# EAGLE design controller_up (EAGLE 5.00)
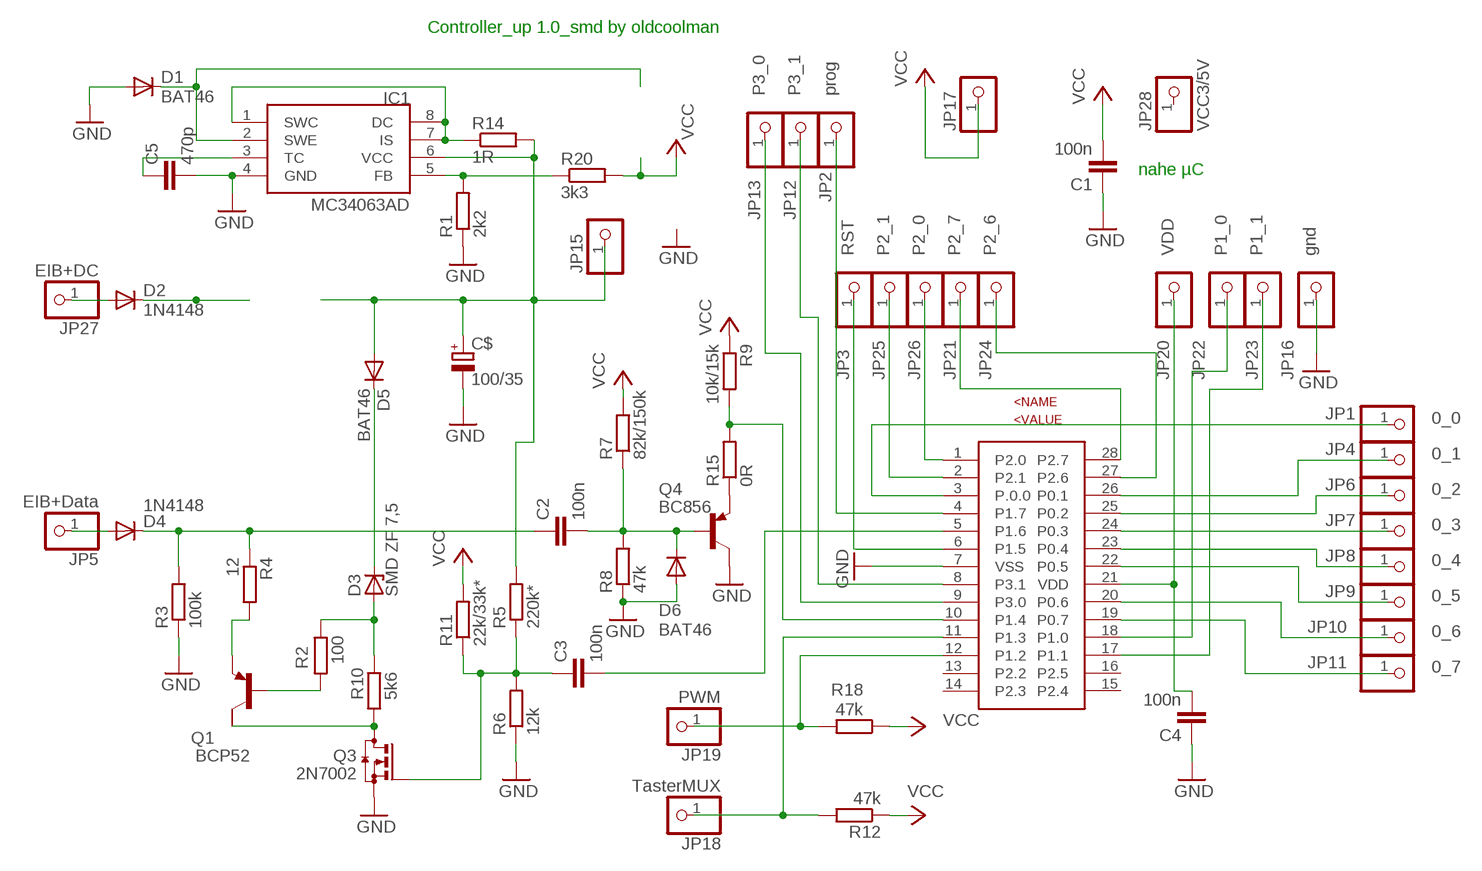
[diagram p0: schematic, sheet 1]

## Parts
C1  100n  C-EUC1206  [C1206]
C2  100n  C-EUC1206  [C1206]
C3  100n  C-EUC1206  [C1206]
C4  100n  C-EUC1206  [C1206]
C5  470p  C-EUC1206  [C1206]
C$  100/35  C_EU_HE3,3X13LIEGEND  [E3,3-7,5X13]
D1  BAT46  DIODE-MINIMELF  [MINIMELF]
D2  1N4148  DIODE-MINIMELF  [MINIMELF]
D3  SMD ZF 7,5  ZPD  [MINIMELF]
D4  1N4148  DIODE-MINIMELF  [MINIMELF]
D5  BAT46  DIODE-MINIMELF  [MINIMELF]
D6  BAT46  DIODE-MINIMELF  [MINIMELF]
IC1  MC34063AD  [SOIC8]
JP1  0_0  PINHD-1X1  [1X01]
JP2  prog  PINHD-1X1  [1X01]
JP3  RST  PINHD-1X1  [1X01]
JP4  0_1  PINHD-1X1  [1X01]
JP5  EIB+Data  PINHD-1X1  [1X01]
JP6  0_2  PINHD-1X1  [1X01]
JP7  0_3  PINHD-1X1  [1X01]
JP8  0_4  PINHD-1X1  [1X01]
JP9  0_5  PINHD-1X1  [1X01]
JP10  0_6  PINHD-1X1  [1X01]
JP11  0_7  PINHD-1X1  [1X01]
JP12  P3_1  PINHD-1X1  [1X01]
JP13  P3_0  PINHD-1X1  [1X01]
JP15  PINHD-1X1  [1X01]
JP16  gnd  PINHD-1X1  [1X01]
JP17  PINHD-1X1  [1X01]
JP18  TasterMUX  PINHD-1X1  [1X01]
JP19  PWM  PINHD-1X1  [1X01]
JP20  VDD  PINHD-1X1  [1X01]
JP21  P2_7  PINHD-1X1  [1X01]
JP22  P1_0  PINHD-1X1  [1X01]
JP23  P1_1  PINHD-1X1  [1X01]
JP24  P2_6  PINHD-1X1  [1X01]
JP25  P2_1  PINHD-1X1  [1X01]
JP26  P2_0  PINHD-1X1  [1X01]
JP27  EIB+DC  PINHD-1X1  [1X01]
JP28  VCC3/5V  PINHD-1X1  [1X01]
Q1  BCP52  FZT753SMD  [SOT223]
Q3  2N7002  BSS123  [SOT23]
Q4  BC856  BC856ALT1SMD  [SOT23-BEC]
R1  2k2  R-EU_R1206  [R1206]
R2  100  R-EU_M1206  [M1206]
R3  100k  R-EU_M1206  [M1206]
R4  12  R-EU_R1206  [R1206]
R5  220k*  R-EU_R1206  [R1206]
R6  12k  R-EU_M1206  [M1206]
R7  82k/150k  R-EU_R1206  [R1206]
R8  47k  R-EU_M1206  [M1206]
R9  10k/15k  R-EU_R1206  [R1206]
R10  5k6  R-EU_M1206  [M1206]
R11  22k/33k*  R-EU_R1206  [R1206]
R12  47k  R-EU_M1206  [M1206]
R14  1R  R-EU_M1206  [M1206]
R15  0R  R-EU_M1206  [M1206]
R18  47k  R-EU_M1206  [M1206]
R20  3k3  R-EU_M1206  [M1206]
U$1  LPC936TSSOP28  [TSSOP28]

## Nets
GND: C1.1 C4.1 C5.2 C$.- D1.A D6.A IC1.4(GND) JP16.1 Q3.2(S) Q4.C R1.1 R3.1 R6.1 R8.1 U$1.7(VSS)
N$1: R9.2 R15.2 U$1.10(P1.4)
N$2: C2.2 D6.C Q4.B R7.1 R8.2
N$3: IC1.5(FB) R1.2 R20.1
N$4: IC1.1(SWC) IC1.7(IS) IC1.8(DC) R14.1
N$5: C3.2 U$1.5(P1.6)
N$6: Q1.2(C) Q3.3(D) R10.1
N$7: C$.+ D5.A IC1.6(VCC) JP15.1 R5.2 R14.2
N$8: D2.C
N$9: C2.1 D4.C R3.2 R4.1
N$10: D1.C IC1.2(SWE)
N$11: D3.A R2.1 R10.2
N$12: Q1.3(E) R4.2
N$13: C5.1 IC1.3(TC)
N$14: Q1.1(B) R2.2
N$15: JP2.1 U$1.4(P1.7)
N$16: JP21.1 U$1.28(P2.7)
N$17: JP4.1 U$1.26(P0.1)
N$18: JP1.1 U$1.3(P.0.0)
N$19: JP6.1 U$1.25(P0.2)
N$20: JP7.1 U$1.24(P0.3)
N$21: JP8.1 U$1.23(P0.4)
N$22: JP9.1 U$1.22(P0.5)
N$23: JP10.1 U$1.20(P0.6)
N$24: JP11.1 U$1.19(P0.7)
N$25: JP12.1 U$1.8(P3.1)
N$26: JP13.1 U$1.9(P3.0)
N$28: D2.A JP27.1
N$29: JP22.1 U$1.18(P1.0)
N$30: JP23.1 U$1.17(P1.1)
N$31: JP3.1 U$1.6(P1.5)
N$32: C4.2 JP20.1 U$1.21(VDD)
N$33: JP19.1 R18.2 U$1.12(P1.2)
N$34: C3.1 Q3.1(G) R5.1 R6.2 R11.1
N$35: Q4.E R15.1
N$36: JP24.1 U$1.27(P2.6)
N$37: JP26.1 U$1.1(P2.0)
N$38: JP25.1 U$1.2(P2.1)
N$40: D3.C D5.C
N$42: JP18.1 R12.2 U$1.11(P1.3)
N$44: D4.A JP5.1
VCC: C1.2 JP17.1 R7.2 R9.1 R11.2 R12.1 R18.1 R20.2
Unconnected: JP28.1 Q1.4(C/) U$1.13(P2.2) U$1.14(P2.3) U$1.15(P2.4) U$1.16(P2.5)

## Notes on the sheet
- Controller_up 1.0_smd by oldcoolman
- nahe µC

## Library data of the parts
C1-C5 = rcl:C-EU: CAPACITOR, European symbol
C$ = rcl:C_EU_H
D1 D2 D4-D6 = diode:DIODE-: DIODE
D3 = diode:ZPD: Z DIODE 500 mW
IC1 = mc34063:MC34063
JP1-JP13 JP15-JP28 = pinhead:PINHD-1X1: PIN HEADER
Q1 = transistor-pnp:FZT753SMD: PNP Transistor
Q3 = transistor-small-signal:BSS123: N-CHANNEL MOS FET
Q4 = transistor-pnp:BC856*: PNP Transistror
R1-R12 R14 R15 R18 R20 = rcl:R-EU_: RESISTOR, European symbol
U$1 = freebuslpc:LPC936: C51 Based Microcontroller LPC936 ADC and 16kbyte Flash

## Board
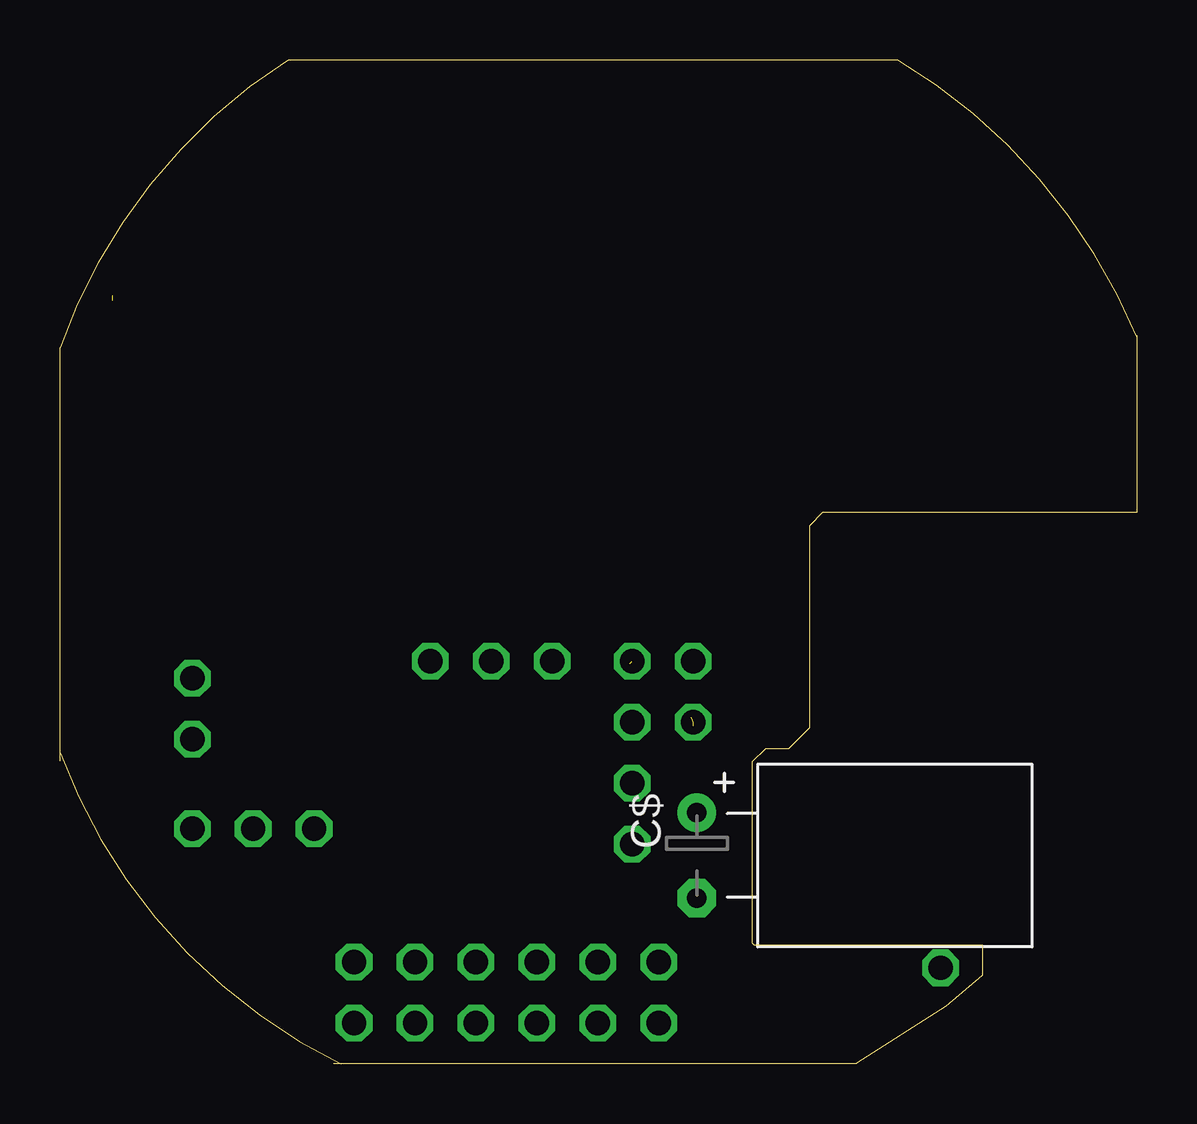
[diagram p1: board, top side]
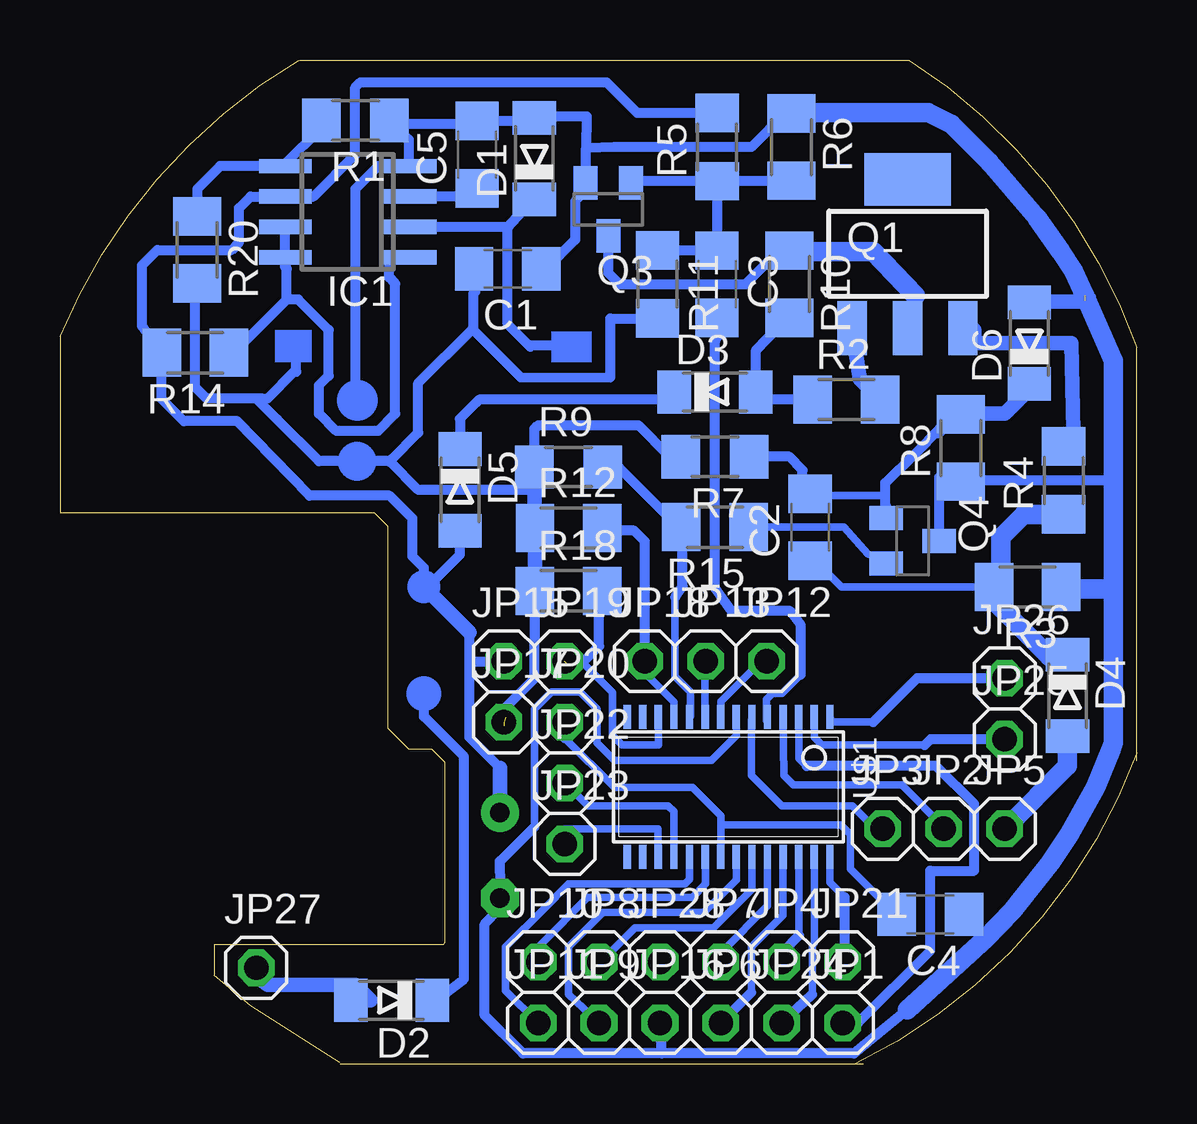
[diagram p2: board, bottom side, seen from below]

Size 44.89 x 41.84 mm. Coordinates in mm from the lower left corner, seen from the top.
Outline: 34.91,41.84 9.5,41.84 arc38 0,29.85
Outline: 0.01,12.63 0,29.85
Outline: 33.21,0 11.41,0
Outline: 44.89,30.31 arc36 34.92,41.84
Outline: 0.01,12.96 arc44 11.72,0
Outline: 44.88,30.35 44.88,22.97 31.79,22.97 31.23,22.42 31.23,14 30.36,13.13 29.4,13.13 28.85,12.57 28.85,5.03 28.93,4.95 38.45,4.95 38.45,3.68 36.95,2.41 33.21,0.03
Copper layers (1*16): Top 0.035mm / dielectric 1.5mm / Bottom 0.035mm
Design rules "default": minimum track width 10mil, minimum drill 24mil, track to track 8mil, track to pad 8mil, pad to pad 8mil, via to via 8mil, smd to smd 8mil, copper to edge 40mil, drill to drill 8mil, minimum pad ring 10mil, minimum via ring 8mil, stop-mask expansion 4mil, vias tented up to drill 0mil, thermal gap 10mil

### Footprints (pad centres in the part's own frame; a part is rotated, then mirrored left to right if it is on the bottom)
C1206 = smd 1.6 x 1.8: 1 -1.4,0; 2 1.4,0
E3,3-7,5X13 = drill 0.813 pad 1.6 round: + -1.778,0 | drill 0.813 pad 1.6 octagon: - 1.778,0
MINIMELF = smd 1.4 x 1.8: A 1.7,0; C -1.7,0
SOIC8 = smd 0.6 x 2.2: 1 -1.905,-2.6; 2 -0.635,-2.6; 3 0.635,-2.6; 4 1.905,-2.6; 5 1.905,2.6; 6 0.635,2.6; 7 -0.635,2.6; 8 -1.905,2.6
1X01 = drill 1.016 octagon: 1 0,0
SOT223 = smd 1.219 x 2.235: 1 -2.311,-3.099; 2 0,-3.099; 3 2.311,-3.099 | smd 3.6 x 2.2: 4 0,3.099
SOT23 = smd 1 x 1.4: 1 -0.95,-1.1; 2 0.95,-1.1; 3 0,1.1
SOT23-BEC = smd 1 x 1.4: B -0.95,-1.1; C 0,1.1; E 0.95,-1.1
R1206 = smd 1.6 x 1.803: 1 -1.422,0; 2 1.422,0
M1206 = smd 1.6 x 2: 1 -1.4,0; 2 1.4,0
TSSOP28 = smd 0.305 x 0.991: 1 -4.225,-2.918; 2 -3.575,-2.918; 3 -2.925,-2.918; 4 -2.275,-2.918; 5 -1.625,-2.918; 6 -0.975,-2.918; 7 -0.325,-2.918; 8 0.325,-2.918; 9 0.975,-2.918; 10 1.625,-2.918; 11 2.275,-2.918; 12 2.925,-2.918; 13 3.575,-2.918; 14 4.225,-2.918; 15 4.225,2.918; 16 3.575,2.918; 17 2.925,2.918; 18 2.275,2.918; 19 1.625,2.918; 20 0.975,2.918; 21 0.325,2.918; 22 -0.325,2.918; 23 -0.975,2.918; 24 -1.625,2.918; 25 -2.275,2.918; 26 -2.925,2.918; 27 -3.575,2.918; 28 -4.225,2.918

### Placement (x,y rotation side)
C1  26.23,33.13 180 bottom
C2  13.62,22.37 90 bottom
C3  17.5,32.5 270 bottom
C4  8.61,6.22 180 bottom
C5  27.5,37.89 90 bottom
C$  26.55,8.69 270 top
D1  25.12,37.74 90 bottom
D2  31.07,2.65 180 bottom
D3  17.59,28 0 bottom
D4  2.89,15.35 270 bottom
D5  28.21,23.93 270 bottom
D6  4.48,30.04 90 bottom
IC1  32.9,35.51 90 bottom
JP1  12.26,1.7 0 bottom
JP2  8.05,9.8 0 bottom
JP3  10.59,9.8 0 bottom
JP4  14.8,4.24 0 bottom
JP5  5.51,9.8 0 bottom
JP6  17.34,1.7 0 bottom
JP7  17.34,4.24 0 bottom
JP8  22.42,4.24 0 bottom
JP9  22.42,1.7 0 bottom
JP10  24.96,4.24 0 bottom
JP11  24.96,1.7 0 bottom
JP12  15.44,16.78 0 bottom
JP13  17.98,16.78 0 bottom
JP15  26.39,16.78 0 bottom
JP16  19.88,1.7 0 bottom
JP17  26.39,14.24 0 bottom
JP18  20.52,16.78 0 bottom
JP19  23.85,16.78 0 bottom
JP20  23.85,14.24 0 bottom
JP21  12.26,4.24 0 bottom
JP22  23.85,11.7 0 bottom
JP23  23.85,9.16 0 bottom
JP24  14.8,1.7 0 bottom
JP25  5.51,13.53 0 bottom
JP26  5.51,16.07 0 bottom
JP27  36.71,4 0 bottom
JP28  19.88,4.24 0 bottom
Q1  9.56,33.77 0 bottom
Q3  22.03,35.62 180 bottom
Q4  9.35,21.8 270 bottom
R1  32.58,39.32 180 bottom
R2  12.11,27.68 0 bottom
R3  4.56,19.88 180 bottom
R4  3.05,24.32 90 bottom
R5  17.5,38.21 90 bottom
R6  14.4,38.21 270 bottom
R7  17.59,25.3 180 bottom
R8  7.34,25.67 90 bottom
R9  23.69,24.88 0 bottom
R10  14.48,32.5 270 bottom
R11  19.98,32.49 270 bottom
R12  23.69,22.34 0 bottom
R14  39.25,29.64 180 bottom
R15  17.59,22.37 180 bottom
R18  23.69,19.72 0 bottom
R20  39.17,33.93 270 bottom
U$1  17.02,11.54 180 bottom

### Tracks (layer width: path | path; a pad name or v marks a point on that pad's centre or on a via)
GND  (1 unrouted)
  Bottom 0.305: U$1.7 16.7,13.69 17.74,12.65 21.78,12.65 22.5,13.37 22.5,14.79 23.21,15.51 24.4,15.51 25.12,14.79 25.12,11.7 | 25.12,9.88 25.12,11.7 | 25.12,11.7 | 6.16,5.04 6.15,5.03 | 6.32,5.2 6.16,5.04 | C4.1 7.13,6.01 6.16,5.04
  Bottom 0.406: 30.36,38.52 R1.1 | 30.36,38.52 30.36,37.42 | 30.36,37.42 IC1.4 | 30.36,37.42 31.63,37.42 32.58,36.47 32.58,27.89 32.5,27.81 | 0.99,19.8 0.99,19 0.99,19.32 | 30.36,38.52 30.36,38.53 30.99,39.16 27.66,39.16 27.5,39.32 C5.2 25.31,39.29 25.16,39.44 D1.A 24.85,39.44 24.8,39.48 22.92,39.48 22.94,38.17 | 2.6,19.8 R3.1 | 25.12,9.88 26.55,8.45 26.5,6.38 C$.- 26.58,6.46 27.18,5.83 27.18,2.02 25.59,0.43 19.8,0.43 | 9.56,2.26 11.78,0.43 19.8,0.43 | 19.8,0.43 JP16.1 | 0.99,24.32 0.99,24.4 1.07,24.32 6.59,24.32 7.42,24.48 7.23,24.27 R8.1 7.49,24.54 8.25,24.45 Q4.C | 0.99,24.32 | 22.94,38.17 21.78,38.21 16.07,38.21 14.64,39.64 14.61,39.61 R6.1 14.24,39.64 | 22.94,38.17 22.98,38.12 Q3.2 22.98,36.39 23.42,35.95 23.42,34.35 24.64,33.13 C1.1 | 1.92,31.97 2.17,31.81 2.12,31.78
  Bottom 0.61: D6.A 4.33,31.78 4.32,31.78 2.12,31.78
  Bottom 0.813: 2.6,19.8 0.99,19.8 0.99,13.37 1.07,13.13 1.7,11.54 2.81,9.56 3.61,8.37 5.2,6.38 6.32,5.2 6.78,4.8 9.56,2.26 | 0.99,19 0.99,24.32 0.99,29.32 2.18,32.02 2.66,33.05 3.18,33.86 4.16,35.28 6.15,37.58 7.74,39.16 8.69,39.64 14.24,39.64
N$1
  Bottom 0.305: 19.25,19.46 19.24,18.13 19.24,16.15 18.61,15.51 18.61,14.48 18.65,14.44 U$1.10
  Bottom 0.406: R9.2 22.11,24.72 21.95,24.88 21.61,24.88 19.17,22.45 19.07,22.45 R15.2 | 19.41,22.6 19.3,22.5 R15.2 | R15.2 18.94,22.32 18.94,19.91 19.25,19.46
N$2
  Bottom 0.305: 13.86,23.87 13.62,23.87 13.54,23.68 11.8,23.68 10.46,23.68 Q4.B
  Bottom 0.406: R7.1 14.49,25.3 13.94,24.75 13.94,23.95 13.86,23.87 13.94,23.79 C2.2 | R8.2 8.29,26.28 8.22,26.48 9.24,25.43 10.48,24.22 10.48,23.28 10.45,23.25 Q4.B | 4.62,28.48 4.51,28.38 D6.C
  Bottom 0.61: 4.62,28.48 4.62,28 5.51,27.1 7.26,27.1 7.28,27.08 R8.2
N$3
  Bottom 0.406: R20.1 39.17,36.47 38.22,37.42 IC1.5 35.5,37.52 34.01,39.01 R1.2
N$4
  Bottom 0.406: IC1.1 31.15,33.61 31.18,32.79 30.91,32.52 30.91,27.1 31.63,26.39 | IC1.7 35.5,33.19 35.44,33.13 | R14.1 37.66,29.64 35.44,31.86 | 35.44,33.13 IC1.8 | 35.44,31.86 35.44,33.13 | 35.44,31.86 35.44,32.02 | 31.63,26.39 | 31.63,26.39 33.37,26.39 34.09,27.1 34.09,28.29 33.69,28.69 33.69,30.59 34.96,31.86 35.44,31.86
N$5
  Bottom 0.305: 15.43,14.48 15.4,14.44 U$1.5 15.42,14.32 15.43,14.32 15.43,15.19 15.2,15.43 14.8,15.43 14.01,16.23
  Bottom 0.406: C3.2 17.45,30.38 17.59,30.12 17.59,19.83 16.9,18.87 14.45,18.87 14.01,18.29 14.01,16.23
N$6
  Bottom 0.406: R10.1 14.56,33.77 15.04,33.77 16.31,32.5 16.34,32.5 16.35,32.48 21.55,32.48 22.03,32.96 Q3.3 | Q1.2 9.24,30.67 9.24,32.02 | 9.24,32.02 | 14.43,33.85 R10.1 | R10.1
  Bottom 0.813: 9.24,32.02 10.99,33.85 14.43,33.85
N$7
  Bottom 0.406: 27.82,16.86 27.82,17.97 | 40.68,29.64 | 40.68,29.64 R14.2 40.65,27.71 39.72,26.78 37.5,26.78 34.48,23.69 31.15,23.69 30.2,22.73 30.2,21.15 29.72,20.67 29.72,19.88 | 40.68,29.64 41.47,30.75 41.47,33.29 40.83,33.93 37.74,33.93 37.42,34.24 37.42,35.67 36.95,36.15 IC1.6 34.33,36.15 32.58,37.89 32.58,40.7 32.37,40.91 22.1,40.91 20.83,39.64 R5.2 | 29.72,19.48 | 29.72,19.88 29.72,19.48 | C$.+ 26.47,10.35 | 27.82,16.86 27.82,15.83 27.82,13.61 26.55,12.34 | JP15.1 27.82,16.78 27.82,16.86 | D5.A 28.21,21.23 29.56,19.88 29.72,19.88 | R5.2 | R5.2 | 29.72,19.88 | 29.72,19.48 | 29.72,19.88 29.72,19.48
  Bottom 0.61: 27.82,17.97 29.72,19.88 | C$.+ 26.55,12.34
N$8
  Bottom 0.406: 29.72,14.48 28.06,12.81 28.06,9.8 28.06,9.48 28.06,3.53 29.09,2.73
  Bottom 0.61: 29.09,2.73 29.13,2.61 D2.C
N$9
  Bottom 0.305: C2.1 13.41,20.97 12.32,19.88 5.75,19.88 5.67,19.96 5.59,19.88 R3.2 | 3.05,22.89 R4.1
  Bottom 0.406: R3.2 5.59,19.91
  Bottom 0.813: 5.67,19.96 5.67,21.94 4.72,22.89 3.05,22.89 | D4.C 3.64,16.97 5.83,19.16 5.83,19.8 5.59,19.88 R3.2
N$10
  Bottom 0.406: D1.C 25.44,35.75 26.23,34.88 | 26.23,34.88 IC1.2 | 25.28,29.88 26.23,30.83 26.23,34.88
N$11
  Bottom 0.406: R10.2 14.43,31.15 14.54,31.15 15.87,29.75 D3.A 15.57,27.68 R2.1 | R2.1 13.46,27.68 | R2.1
N$12
  Bottom 0.305: 3.05,25.67 | R4.2 3.05,25.67
  Bottom 0.406: 3.05,25.92 R4.2 | Q1.3 6.93,30.67
  Bottom 0.61: 3.05,25.92 3.13,25.92 2.66,26.39 2.73,30.04 6.78,30.04 6.78,30.59 6.86,30.67 6.87,30.67 Q1.3
N$13
  Bottom 0.406: IC1.3 30.67,36.15 | IC1.3 30.04,36.15 | C5.1 27.63,36.49 28.45,36.15 IC1.3
N$14
  Bottom 0.61: 10.75,27.73 R2.2 | R2.2 10.67,27.66 | Q1.1 11.55,28.54 R2.2
N$15
  Bottom 0.305: U$1.4 14.72,12.02 14.32,11.62 9.8,11.62 7.97,9.8 JP2.1
N$16
  Bottom 0.305: U$1.28 12.8,7.56 12.18,6.94 | JP21.1 12.18,4.56
  Bottom 0.406: 12.18,4.56 12.18,6.94
N$17
  Bottom 0.305: U$1.26 14.1,8.46 14.09,8.45 14.09,5.35
  Bottom 0.406: JP4.1 14.72,4.72 14.09,5.35
N$18
  Bottom 0.305: U$1.3 14.09,14.3 14.09,12.73 13.77,12.42
  Bottom 0.406: JP1.1 11.62,1.7 8.61,4.72 8.61,8.05 6.78,8.05 6.78,10.83 8.37,12.42 13.77,12.42
N$19
  Bottom 0.305: U$1.25 14.75,6.2 16.07,4.87 16.07,2.97
  Bottom 0.406: JP6.1 16.07,2.97
N$20
  Bottom 0.305: U$1.24 15.4,6.58 17.26,4.72
  Bottom 0.406: JP7.1 17.26,4.72
N$21
  Bottom 0.305: U$1.23 16.05,7.28 17.66,5.67 20.91,5.67 22.18,4.4 JP8.1
N$22
  Bottom 0.305: U$1.22 16.7,7.66 18.05,6.3 22.26,6.3 23.69,4.88 23.69,2.89 JP9.1 22.34,1.86
N$23
  Bottom 0.305: U$1.20 17.97,8.47 17.97,7.49 18.53,6.94 22.9,6.94 24.86,4.96 24.88,4.69
  Bottom 0.406: 24.88,4.69 JP10.1
N$24
  Bottom 0.305: U$1.19 18.65,7.69 18.85,7.49 23.69,7.49 24.72,6.46 26.31,4.87 26.31,3.05 JP11.1
N$25
  Bottom 0.305: U$1.8 17.34,14.31 17.34,15.11 15.59,16.86 JP12.1 15.43,16.7 JP12.1
N$26
  Bottom 0.305: JP13.1 18,15.81 U$1.9
N$27
  Bottom 0.406: 25.28,29.96 23.61,29.96
N$28
  Bottom 0.61: D2.A 31.94,2.65 32.58,3.29 36.23,3.29 36.95,3.84 JP27.1
N$29
  Bottom 0.305: 23.85,11.86 JP22.1 23.83,11.94 23.82,11.71 22.87,10.75 19.54,10.75 19.3,10.51 U$1.18
N$30
  Bottom 0.305: U$1.17 19.96,8.47 19.96,9.8 22.26,9.8 23.85,9.8 JP23.1
N$31
  Bottom 0.305: U$1.6 16.07,14.28 16.07,12.02 14.8,10.75 11.86,10.75 10.67,9.56 10.59,9.72 10.51,9.56 JP3.1
N$32
  Bottom 0.305: 23.85,13.58 21.78,11.51 18.53,11.51 17.35,10.33 U$1.21 17.35,9.79 17.26,9.95 12.34,9.95 11.94,9.56 11.94,8.13 9.96,6.14 C4.2
  Bottom 0.406: 23.85,13.58 JP20.1
N$33  (1 unrouted)
  Bottom 0.305: U$1.12 19.95,13.3 19.96,13.29 21.47,13.29 21.86,13.69 21.86,15.48 23.21,16.83 23.77,16.7
  Bottom 0.406: R18.2 22.42,18.82 22.42,17.41 23.08,16.75 23.77,16.7
N$34
  Bottom 0.406: C3.1 | R5.1 | R5.1 14.41,36.79 14.4,36.78 | R5.1 C3.1 | 14.4,36.78 | R6.2 14.4,36.78 | Q3.1 21.02,36.71 21.02,36.78 R5.1 | R11.1 19.95,33.95 19.9,33.9 C3.1
N$35
  Bottom 0.305: Q4.E 11.21,21.25 12.22,22.37 R15.1
N$36
  Bottom 0.305: U$1.27 13.45,8.45 13.45,5.03 13.53,4.87 13.53,2.89
  Bottom 0.406: JP24.1 13.53,2.89
N$37
  Bottom 0.305: U$1.1 12.74,14.24 10.99,14.24
  Bottom 0.406: 10.99,14.24 9.16,16.07 JP26.1
N$38
  Bottom 0.305: U$1.2 13.45,14.3 13.45,13.61 13.13,13.29 8.85,13.29
  Bottom 0.406: 8.85,13.29 8.61,13.53 JP25.1
N$40
  Bottom 0.406: 28.13,25.62 D5.C 28.21,25.67 28.13,25.75 28.21,25.83 28.21,26.89 27.5,27.6 27.42,27.68 19.82,27.68 19.5,28 D3.C
N$42
  Bottom 0.305: 22.18,22.23 R12.2 | U$1.11 19.3,15.09 20.44,16.23 20.44,16.7 JP18.1
  Bottom 0.406: 22.18,22.23 20.96,22.23 20.51,21.78 JP18.1 | JP18.1
N$43
  Bottom 0.406: 35.04,28.85 35.04,29.72
N$44
  Bottom 0.813: D4.A 2.89,12.42 JP5.1 | JP5.1
N$46
  Bottom 0.406: 29.72,14.48 29.72,15.35
VCC  (2 unrouted)
  Bottom 0.305: 26.31,14.43
  Bottom 0.406: 38.9,32.53 R20.2 | 36.47,27.73 36.71,27.73 35.83,26.86 34.09,25.12 32.5,25.12 | 36.47,27.73 36.23,27.73 35.12,28.85 | 38.9,32.53 38.8,32.53 | 38.9,32.53 39.25,32.18 39.25,28.21 38.77,27.73 36.47,27.73 | 31.11,25.08 29.96,23.92 25.28,23.92 25.12,24.09 R9.1 25.11,24.08 25.12,23.92 25.12,26.46 24.96,26.62 20.78,26.62 19.54,25.38 19.02,25.38 R7.2 | 31.11,25.08 31.15,25.12 32.5,25.12 | C1.2 27.63,32.23 27.58,32.18 27.66,32.1 27.66,30.67 27.7,30.63 | JP17.1 26.39,14.79 25.12,16.06 25.12,17.65 25.09,17.68 R18.1 | 27.7,30.63 29.96,28.37 29.96,26.31 31.07,25.19 31.07,25.12 | 31.07,25.12 | 31.11,25.08 31.07,25.12 | R11.2 21.94,31.07 21.94,28.61 25.69,28.62 27.7,30.63 | 27.7,30.63 | 32.5,25.12 | 26.39,14.08
  Bottom 0.61: 25.09,22.31 25.04,22.26 | 25.09,22.31 R12.1 25.09,19.43 25.12,19.4 | 25.12,23.92 25.12,22.34 25.09,22.31 | 25.12,19.4 | R18.1 25.12,19.4
(copper drawn outside any net)
  shapes: Bottom area x2, Bottom circle x4